# EAGLE schematic SmartMatrixShield_V1 (EAGLE 6.4)
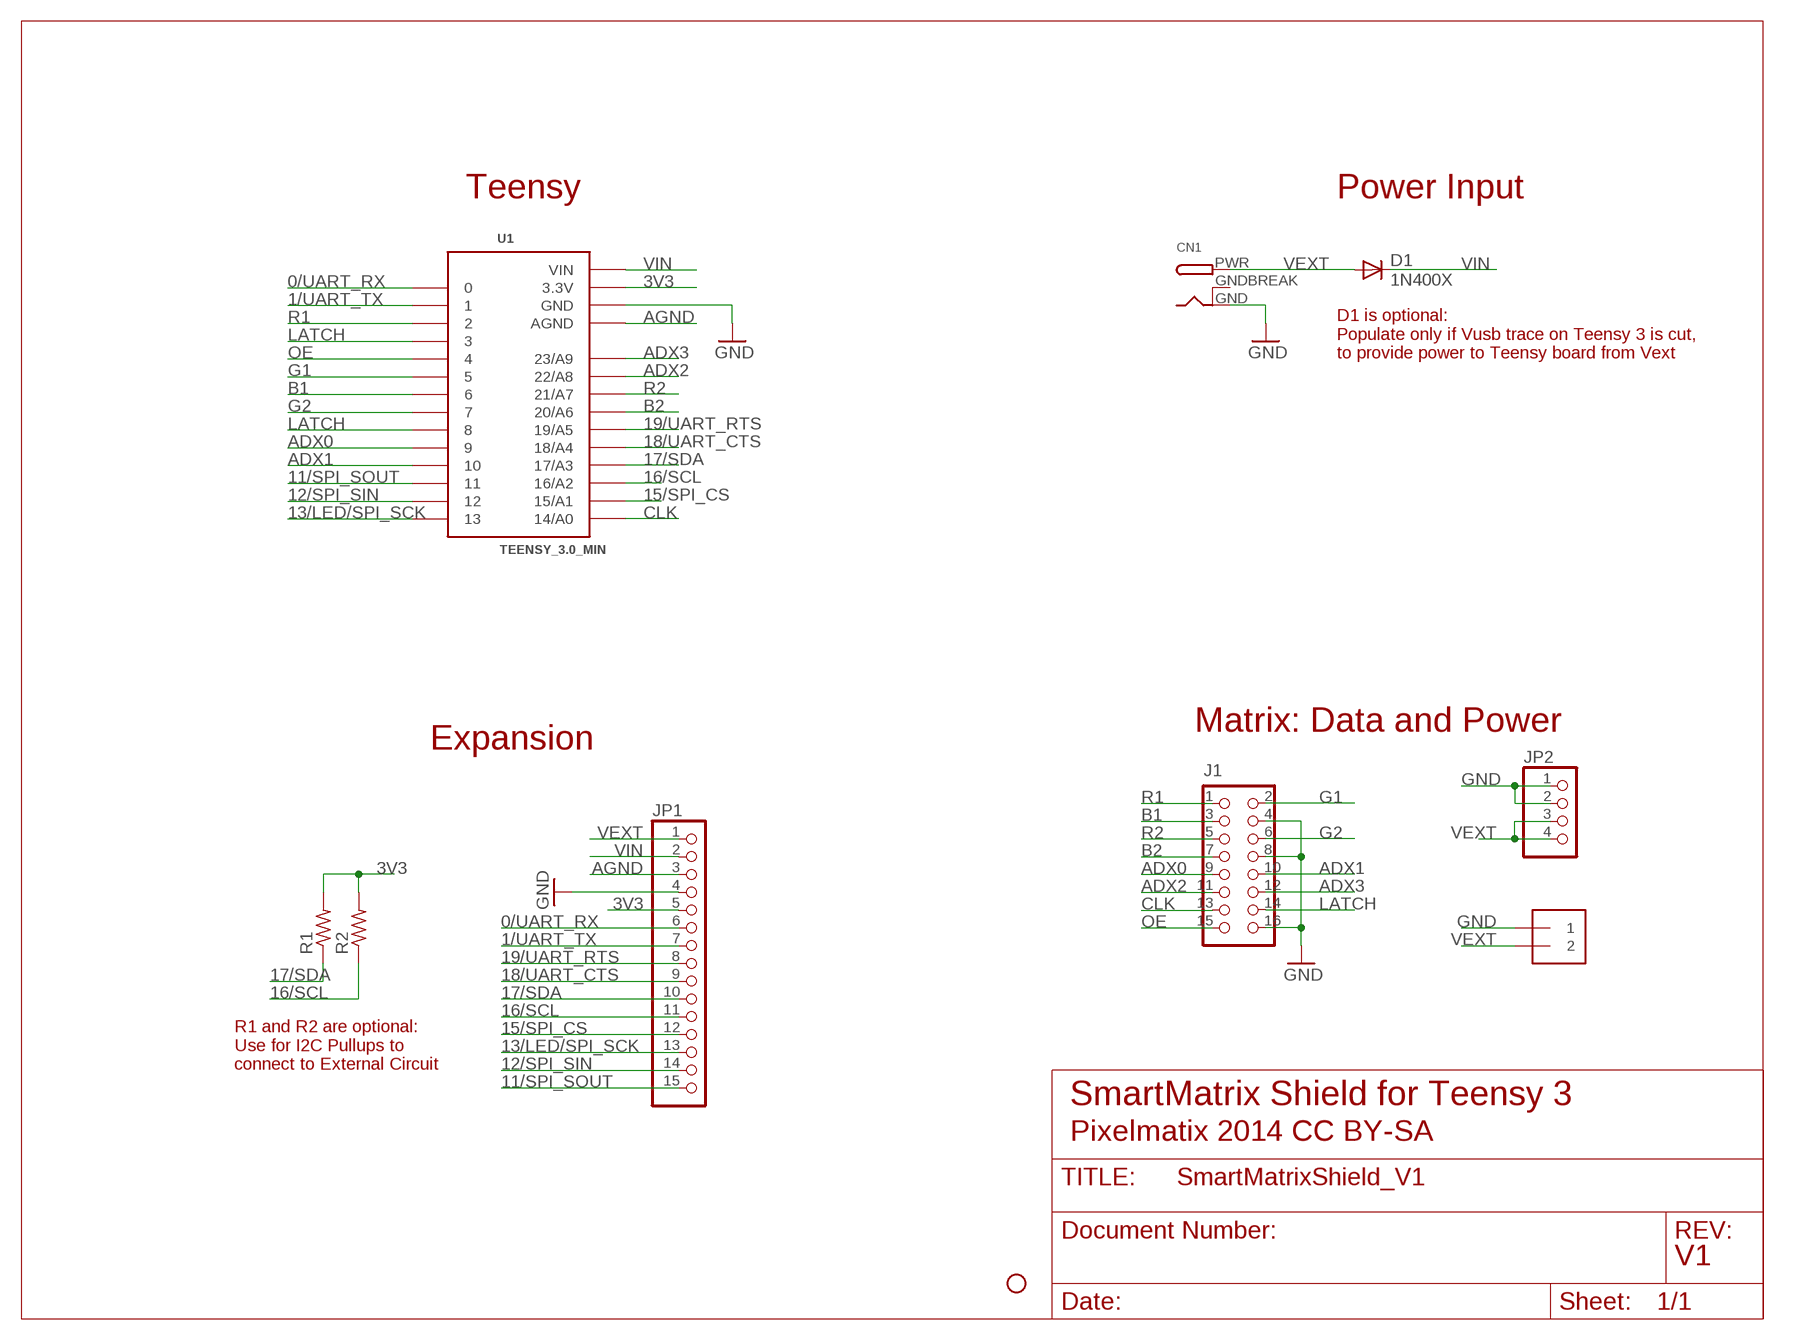
[diagram p0: schematic, sheet 1]

## Parts
CN1  DCBARRELPTH  [DCJACK_2MM_PTH]
D1  1N400X  [DIODE-TH-0.3"]
J1  CON_HEADER_2X08-PTH-SHROUDED  [PINSHRD_PTH_2X08]
J4  1X2-5.0  [1X2-5.0MM]
JP1  PINHD-1X15_2.54-S  [1X15-S]
JP2  PINHD-1X04_1.56  [1X04-1.56"]
JP5  STAND-OFFSTAND-OFF-3MM  [STAND-OFF-3MM]
R1  R-US_0207/7  [0207/7]
R2  R-US_0207/7  [0207/7]
U1  TEENSY_3.0_MIN  [TEENSY_3.0_MIN]

## Nets
0/UART_RX: JP1.6 U1.0
1/UART_TX: JP1.7 U1.1
3V3 [power]: JP1.5 R1.2 R2.2 U1.3.3V
11/SPI_SOUT: JP1.15 U1.11
12/SPI_SIN: JP1.14 U1.12
13/LED/SPI_SCK: JP1.13 U1.13
15/SPI_CS: JP1.12 U1.15/A1
16/SCL: JP1.11 R2.1 U1.16/A2
17/SDA: JP1.10 R1.1 U1.17/A3
18/UART_CTS: JP1.9 U1.18/A4
19/UART_RTS: JP1.8 U1.19/A5
ADX0: J1.9 U1.9
ADX1: J1.10 U1.10
ADX2: J1.11 U1.22/A8
ADX3: J1.12 U1.23/A9
AGND [power]: JP1.3 U1.AGND
B1: J1.3 U1.6
B2: J1.7 U1.20/A6
CLK: J1.13 U1.14/A0
G1: J1.2 U1.5
G2: J1.6 U1.7
GND [power]: CN1.GND J1.4 J1.8 J1.16 J4.1 JP1.4 JP2.1 JP2.2 U1.GND
LATCH: J1.14 U1.3 U1.8
OE: J1.15 U1.4
R1: J1.1 U1.2
R2: J1.5 U1.21/A7
VEXT [power]: CN1.PWR D1.A J4.2 JP1.1 JP2.3 JP2.4
VIN [power]: D1.C JP1.2 U1.VIN

## Notes on the sheet
- Teensy | Power Input
- D1 is optional:
  Populate only if Vusb trace on Teensy 3 is cut,
  to provide power to Teensy board from Vext
- Matrix: Data and Power
- Expansion
- R1 and R2 are optional:
  Use for I2C Pullups to
  connect to External Circuit
- SmartMatrix Shield for Teensy 3
- Pixelmatix 2014 CC BY-SA
- V1

## Power pins joined to a net without a drawn wire
GNDBREAK: CN1.GNDBREAK

## Library data of the parts
CN1 = adafruit:DCBARREL: 2.0mm DC Barrel Jack DCJACK_2MM_PTH - Through Hole Jack (4UConnector: 05537)
D1 = eclibrary:1N400X
J1 = eclibrary:CON_HEADER_2X08: 2x07 pin header
J4 = eclibrary:1X2: 3.5mm Terminal block - matches dimensions of 4Uconnector part# 19974 from http://www.ladyada.net/library/pcb/eaglelibrary.html 5.0mm Terminal block - matches dimensions of 4Uconnector part# 20182
JP1 = pinhead-2:PINHD-1X15: PIN HEADER
JP2 = eclibrary:PINHD-1X04: PIN HEADER
JP5 = eclibrary:STAND-OFF: Stand Off STAND-OFF-2.5MM is Using dimensions for 4.5mm diameter Hex Standoff (2.598mm keepout radius = outer radius of standoff) STAND-OFF-3MM is Using dimensions for a 6mm diameter Hex screw (3mm keepout radius), assuming a smaller 4.5mm diameter hex standoff is used Other parts are from sparkfun sample
R1 R2 = rcl:R-US_: RESISTOR, American symbol
U1 = eclibrary:TEENSY_3.0_MIN: Basic Teensy 3.0 with none of the 'inner' pins enabled. See '+4', 'AllAnalogPins", and 'AllPins' packages for additional pin holes, as needed.

## Net classes
0 default: width 0.254 mm
1 power: width 0.406 mm